# EAGLE schematic Sch (EAGLE 9.6.0)
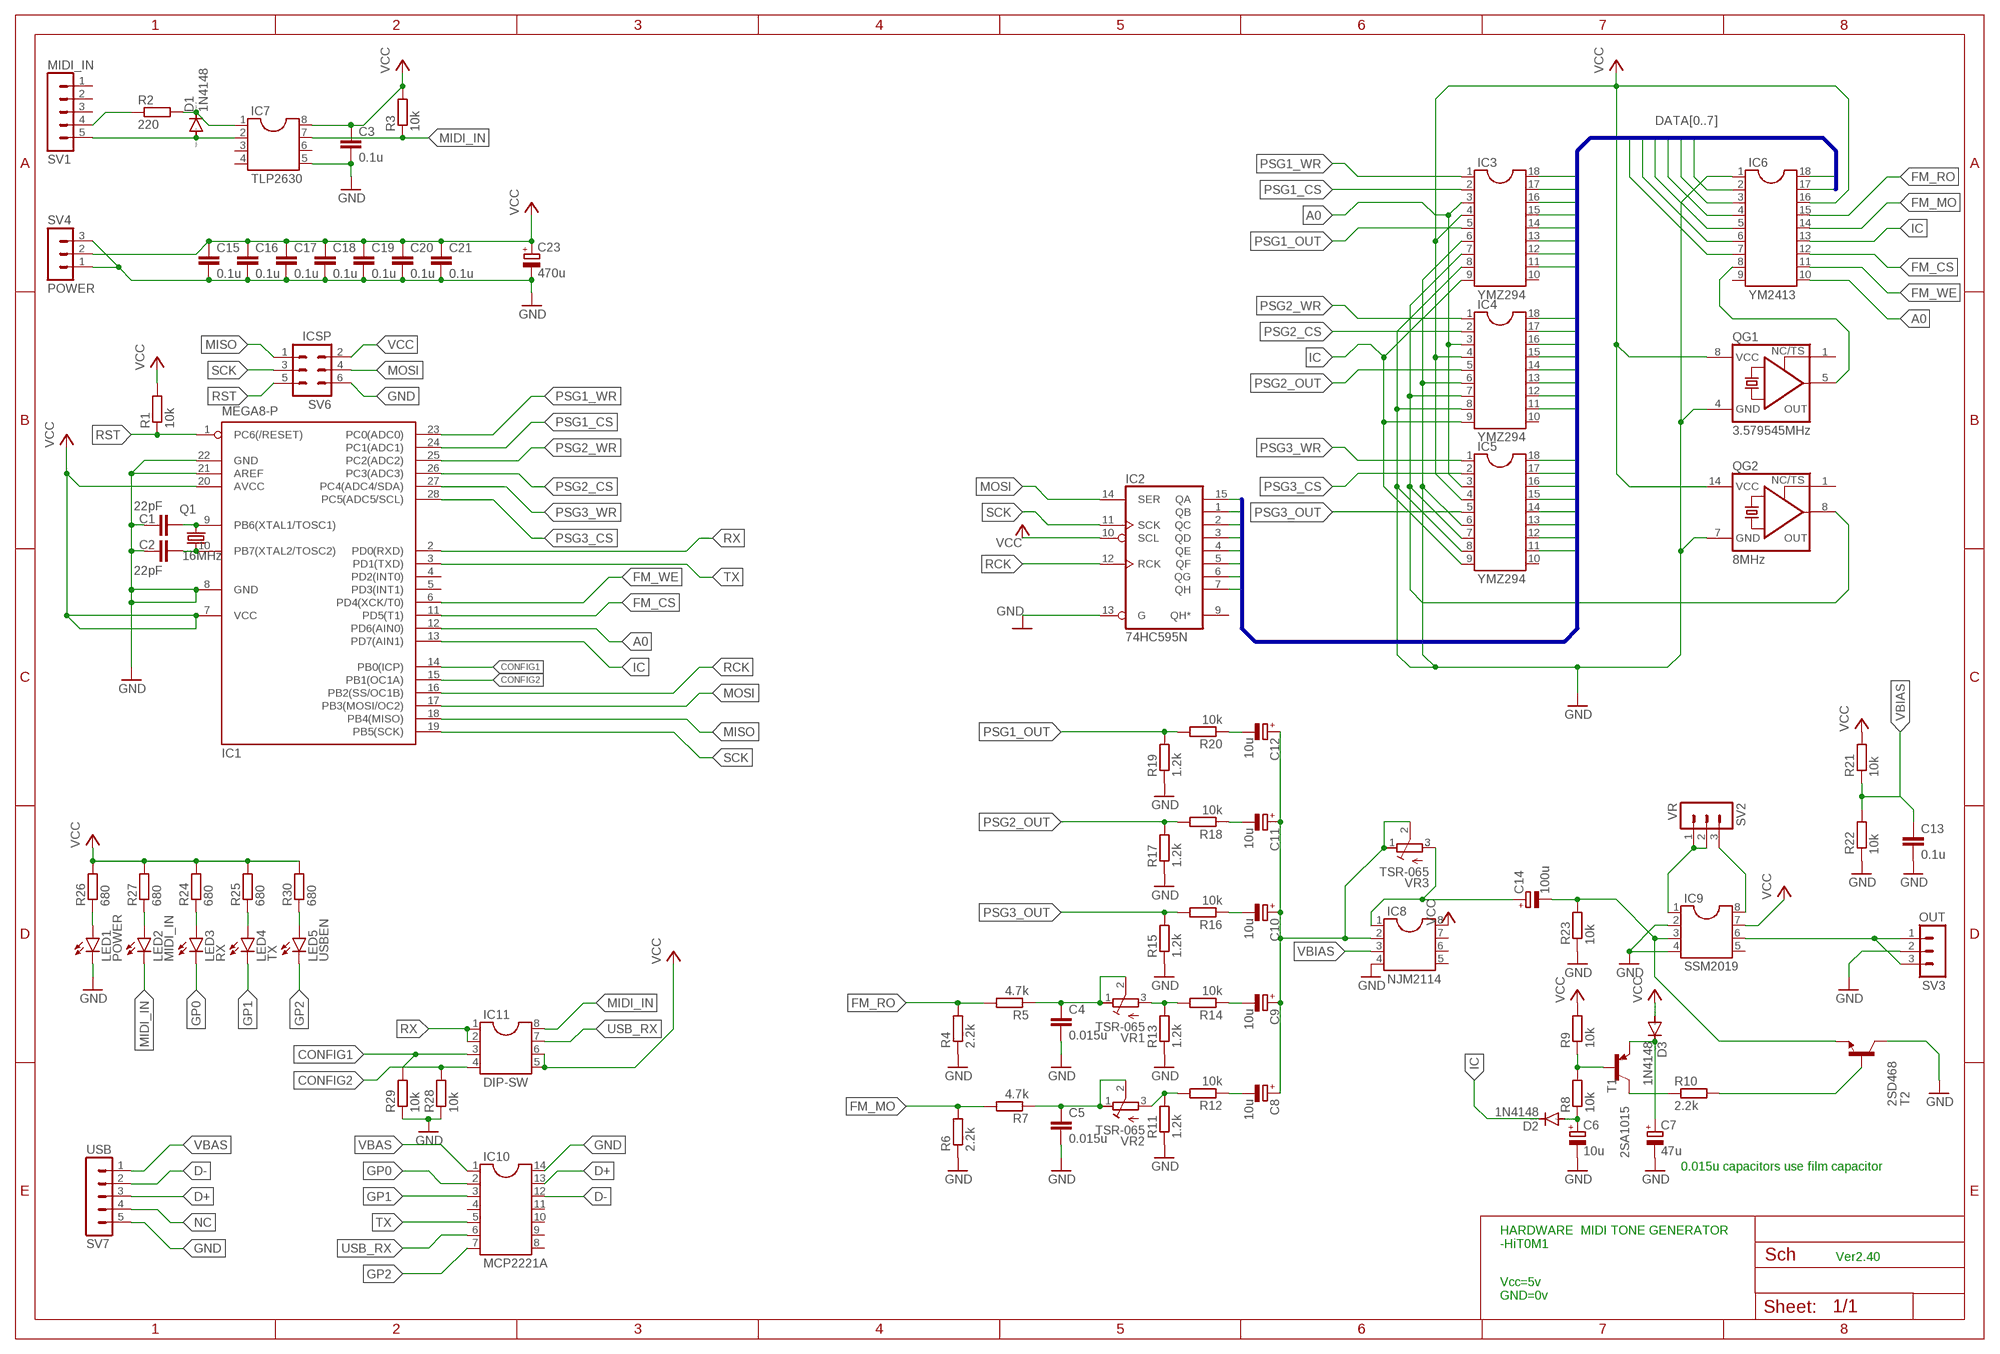
[diagram p0: schematic, sheet 1]

## Parts
C1  22pF  C-EU050-025X075  [C050-025X075]
C2  22pF  C-EU050-025X075  [C050-025X075]
C3  0.1u  C-EU025-030X050  [C025-030X050]
C4  0.015u  C-EU050-025X075  [C050-025X075]
C5  0.015u  C-EU050-025X075  [C050-025X075]
C6  10u  CPOL-EUE2.5-5  [E2,5-5]
C7  47u  CPOL-EUE2.5-5  [E2,5-5]
C8  10u  CPOL-EUE2.5-5  [E2,5-5]
C9  10u  CPOL-EUE2.5-5  [E2,5-5]
C10  10u  CPOL-EUE2.5-5  [E2,5-5]
C11  10u  CPOL-EUE2.5-5  [E2,5-5]
C12  10u  CPOL-EUE2.5-5  [E2,5-5]
C13  0.1u  C-EU025-030X050  [C025-030X050]
C14  100u  CPOL-EUE2.5-5  [E2,5-5]
C15  0.1u  C-EU025-030X050  [C025-030X050]
C16  0.1u  C-EU025-030X050  [C025-030X050]
C17  0.1u  C-EU025-030X050  [C025-030X050]
C18  0.1u  C-EU025-030X050  [C025-030X050]
C19  0.1u  C-EU025-030X050  [C025-030X050]
C20  0.1u  C-EU025-030X050  [C025-030X050]
C21  0.1u  C-EU025-030X050  [C025-030X050]
C23  470u  CPOL-EUE2.5-5  [E2,5-5]
D1  1N4148  1N4148DO35-7  [DO35-7]
D2  1N4148  1N4148DO35-7  [DO35-7]
D3  1N4148  1N4148DO35-7  [DO35-7]
IC1  MEGA8-P  [DIL28-3]
IC2  74HC595N  [DIL16]
IC3  YMZ294  DIL18S  [SOCKET-18]
IC4  YMZ294  DIL18S  [SOCKET-18]
IC5  YMZ294  DIL18S  [SOCKET-18]
IC6  YM2413  DIL18S  [SOCKET-18]
IC7  TLP2630  DIL8S  [SOCKET-08]
IC8  NJM2114  DIL8S  [SOCKET-08]
IC9  SSM2019  DIL8S  [SOCKET-08]
IC10  MCP2221A  DIL14S  [SOCKET-14]
IC11  DIP-SW  DIL8S  [SOCKET-08]
LED1  POWER  LED3MM  [LED3MM]
LED2  MIDI_IN  LED3MM  [LED3MM]
LED3  RX  LED3MM  [LED3MM]
LED4  TX  LED3MM  [LED3MM]
LED5  USBEN  LED3MM  [LED3MM]
Q1  16MHz  CRYSTALHC49S  [HC49/S]
QG1  3.579545MHz  XO-8  [DIL08S]
QG2  8MHz  XO-14  [DIL14S]
R1  10k  R-EU_0207/2V  [0207/2V]
R2  220  R-EU_0207/2V  [0207/2V]
R3  10k  R-EU_0207/2V  [0207/2V]
R4  2.2k  R-EU_0207/2V  [0207/2V]
R5  4.7k  R-EU_0207/2V  [0207/2V]
R6  2.2k  R-EU_0207/2V  [0207/2V]
R7  4.7k  R-EU_0207/2V  [0207/2V]
R8  10k  R-EU_0207/2V  [0207/2V]
R9  10k  R-EU_0207/2V  [0207/2V]
R10  2.2k  R-EU_0207/2V  [0207/2V]
R11  1.2k  R-EU_0207/2V  [0207/2V]
R12  10k  R-EU_0207/2V  [0207/2V]
R13  1.2k  R-EU_0207/2V  [0207/2V]
R14  10k  R-EU_0207/2V  [0207/2V]
R15  1.2k  R-EU_0207/2V  [0207/2V]
R16  10k  R-EU_0207/2V  [0207/2V]
R17  1.2k  R-EU_0207/2V  [0207/2V]
R18  10k  R-EU_0207/2V  [0207/2V]
R19  1.2k  R-EU_0207/2V  [0207/2V]
R20  10k  R-EU_0207/2V  [0207/2V]
R21  10k  R-EU_0207/2V  [0207/2V]
R22  10k  R-EU_0207/2V  [0207/2V]
R23  10k  R-EU_0207/2V  [0207/2V]
R24  680  R-EU_0207/2V  [0207/2V]
R25  680  R-EU_0207/2V  [0207/2V]
R26  680  R-EU_0207/2V  [0207/2V]
R27  680  R-EU_0207/2V  [0207/2V]
R28  10k  R-EU_0207/2V  [0207/2V]
R29  10k  R-EU_0207/2V  [0207/2V]
R30  680  R-EU_0207/2V  [0207/2V]
SV1  MIDI_IN  MA05-1  [MA05-1]
SV2  VR  MA03-1  [MA03-1]
SV3  OUT  MA03-1  [MA03-1]
SV4  POWER  MA03-1  [MA03-1]
SV6  ICSP  MA03-2  [MA03-2]
SV7  USB  MA05-1  [MA05-1]
T1  2SA1015  -PNP-TO92  [TO92]
T2  2SD468  -NPN-TO92  [TO92]
VR1  TSR-065  [TSR-065]
VR2  TSR-065  [TSR-065]
VR3  TSR-065  [TSR-065]

## Nets
A0: IC1.12(PD6(AIN0)) IC3.3 IC4.3 IC5.3 IC6.10
CONFIG1: IC1.14(PB0(ICP)) IC11.3 R29.2
CONFIG2: IC1.15(PB1(OC1A)) IC11.4 R28.2
D+: IC10.13 SV7.3
D-: IC10.12 SV7.2
DATA0: IC2.15(QA) IC3.18 IC4.18 IC5.18 IC6.17
DATA1: IC2.1(QB) IC3.17 IC4.17 IC5.17 IC6.18
DATA2: IC2.2(QC) IC3.16 IC4.16 IC5.16 IC6.2
DATA3: IC2.3(QD) IC3.15 IC4.15 IC5.15 IC6.3
DATA4: IC2.4(QE) IC3.14 IC4.14 IC5.14 IC6.4
DATA5: IC2.5(QF) IC3.13 IC4.13 IC5.13 IC6.5
DATA6: IC2.6(QG) IC3.12 IC4.12 IC5.12 IC6.6
DATA7: IC2.7(QH) IC3.11 IC4.11 IC5.11 IC6.7
FM_CS: IC1.11(PD5(T1)) IC6.12
FM_MO: IC6.14 R6.2 R7.2
FM_RO: IC6.15 R4.2 R5.2
FM_WE: IC1.6(PD4(XCK/T0)) IC6.11
GND: C1.2 C2.2 C3.2 C4.2 C5.2 C6.- C7.- C13.2 C15.2 C16.2 C17.2 C18.2 C19.2 C20.2 C21.2 C23.- IC1.8(GND) IC1.21(AREF) IC1.22(GND) IC2.13(G) IC3.6 IC3.8 IC4.6 IC4.8 IC5.6 IC5.8 IC6.1 IC7.5 IC8.4 IC9.2 IC9.4 IC10.14 LED1.K(C) QG1.4(GND) QG2.7(GND) R4.1 R6.1 R11.1 R13.1 R15.1 R17.1 R19.1 R22.1 R23.1 R28.1 R29.1 SV3.2 SV4.1 SV4.3 SV6.6 SV7.5 T2.3(C)
GP0: IC10.2 LED3.K(C)
GP1: IC10.3 LED4.K(C)
GP2: IC10.7 LED5.K(C)
IC: D2.C IC1.13(PD7(AIN1)) IC3.9 IC4.9 IC5.9 IC6.13
MIDI_IN: IC7.7 IC11.8 LED2.K(C) R3.1
MISO: IC1.18(PB4(MISO)) SV6.1
MOSI: IC1.17(PB3(MOSI/OC2)) IC2.14(SER) SV6.4
N$1: R2.1 SV1.4
N$2: D1.A IC7.2 SV1.5
N$3: C1.1 IC1.9(PB6(XTAL1/TOSC1)) Q1.2
N$4: C2.1 IC1.10(PB7(XTAL2/TOSC2)) Q1.1
N$5: D1.C IC7.1 R2.2
N$6: IC3.7 IC4.7 IC5.7 QG2.8(OUT)
N$7: C6.+ D2.A R8.1
N$8: C4.1 R5.1 VR1.1(A) VR1.2(S)
N$9: IC6.8 QG1.5(OUT)
N$10: C8.+ C9.+ C10.+ C11.+ C12.+ IC8.2 VR3.1(A) VR3.2(S)
N$11: C5.1 R7.1 VR2.1(A) VR2.2(S)
N$12: LED3.A R24.1
N$13: R8.2 R9.1 T1.2(B)
N$14: C7.+ D3.C T1.1(E)
N$15: R10.1 T1.3(C)
N$16: R10.2 T2.2(B)
N$17: C14.- IC9.3 R23.2 T2.1(E)
N$18: R11.2 R12.2 VR2.3(E)
N$19: C8.- R12.1
N$20: R13.2 R14.2 VR1.3(E)
N$21: C9.- R14.1
N$22: LED4.A R25.1
N$23: C10.- R16.1
N$24: LED5.A R30.1
N$25: C11.- R18.1
N$26: LED1.A R26.1
N$27: C12.- R20.1
N$29: C14.+ IC8.1 VR3.3(E)
N$30: IC9.1 SV2.1 SV2.2
N$31: IC9.8 SV2.3
N$32: LED2.A R27.1
N$33: IC9.6 SV3.1 SV3.3
NC: SV7.4
PSG1_CS: IC1.24(PC1(ADC1)) IC3.2
PSG1_OUT: IC3.5 R19.2 R20.2
PSG1_WR: IC1.23(PC0(ADC0)) IC3.1
PSG2_CS: IC1.26(PC3(ADC3)) IC4.2
PSG2_OUT: IC4.5 R17.2 R18.2
PSG2_WR: IC1.25(PC2(ADC2)) IC4.1
PSG3_CS: IC1.28(PC5(ADC5/SCL)) IC5.2
PSG3_OUT: IC5.5 R15.2 R16.2
PSG3_WR: IC1.27(PC4(ADC4/SDA)) IC5.1
RCK: IC1.16(PB2(SS/OC1B)) IC2.12(RCK)
RST: IC1.1(PC6(/RESET)) R1.1 SV6.5
RX: IC1.2(PD0(RXD)) IC11.1 IC11.2
SCK: IC1.19(PB5(SCK)) IC2.11(SCK) SV6.3
TX: IC1.3(PD1(TXD)) IC10.5
USB_RX: IC10.6 IC11.7
VBAS: IC10.1 SV7.1
VBIAS: C13.1 IC8.3 R21.1 R22.2
VCC: C3.1 C15.1 C16.1 C17.1 C18.1 C19.1 C20.1 C21.1 C23.+ D3.A IC1.7(VCC) IC1.20(AVCC) IC2.10(SCL) IC3.4 IC4.4 IC5.4 IC6.16 IC7.8 IC8.8 IC9.7 IC11.5 IC11.6 QG1.8(VCC) QG2.14(VCC) R1.2 R3.2 R9.2 R21.2 R24.2 R25.2 R26.2 R27.2 R30.2 SV4.2 SV6.2
Unconnected: IC1.4(PD2(INT0)) IC1.5(PD3(INT1)) IC2.9(QH*) IC3.10 IC4.10 IC5.10 IC6.9 IC7.3 IC7.4 IC7.6 IC8.5 IC8.6 IC8.7 IC9.5 IC10.4 IC10.8 IC10.9 IC10.10 IC10.11 QG1.1(TS) QG2.1(TS) SV1.1 SV1.2 SV1.3

## Buses
DATA[0..7]

## Notes on the sheet
- 0.015u capacitors use film capacitor
- HARDWARE  MIDI TONE GENERATOR 
  -HiT0M1
- Ver2.40
- Vcc=5v
  GND=0v

## Power pins joined to a net without a drawn wire
GND: IC2.8(GND)
VCC: IC2.16(VCC)

## Library data of the parts
C1-C5 C13 C15-C21 = rcl:C-EU: CAPACITOR, European symbol; SPICEPREFIX: C
C6-C12 C14 C23 = rcl:CPOL-EU: POLARIZED CAPACITOR, European symbol; SPICEPREFIX: C
D1-D3 = diode:1N4148: DIODE high speed (Philips)
IC1 = atmel:MEGA8-P: MICROCONTROLLER 8 Kbytes FLASH, 1 kbytes SRAM, 512 bytes EEPROM, USART, 4-channel 10 bit ADC, 2-channel 8 bit ADC Pin compatible with Atmega48, ATMega88, ATMega168 Source: avr.lbr; OC_FARNELL: unknown; OC_NEWARK: unknown
IC2 = 74xx-eu:74*595: 8-bit SHIFT REGISTER, output latch
IC3-IC6 = ic-package:DIL18: Dual In Line / Socket
IC7-IC9 IC11 = ic-package:DIL8: Dual In Line / Socket
IC10 = ic-package:DIL14: Dual In Line / Socket
LED1-LED5 = led:LED: LED OSRAM: - CHIPLED LG R971, LG N971, LY N971, LG Q971, LY Q971, LO R971, LY R971 LH N974, LH R974 LS Q976, LO Q976, LY Q976 LO Q996 - Hyper CHIPLED LW Q18S LB Q993, LB Q99A, LB R99A - SideLED LS A670, LO A670, LY A670, LG A670, LP A670 LB A673, LV A673, LT A673, LW A673 LH A674 LY A675 LS A676, LA A676, LO A676, LY A676, LW A676 LS A679, LY A679, LG A679 - Hyper Micro SIDELED® LS Y876, LA Y876, LO Y876, LY Y876 LT Y87S - SmartLED LW L88C, LW L88S LB L89C, LB L89S, LG L890 LS L89K, LO L89K, LY L89K LS L896, LA L896, LO L896, LY L896 - TOPLED LS T670, LO T670, LY T670, LG T670, LP T670 LSG T670, LSP T670, LSY T670, LOP T670, LYG T670 LG T671, LOG T671, LSG T671 LB T673, LV T673, LT T673, LW T673 LH T674 LS T676, LA T676, LO T676, LY T676, LB T676, LH T676, LSB T676, LW T676 LB T67C, LV T67C, LT T67C, LS T67K, LO T67K, LY T67K, LW E67C LS E67B, LA E67B, LO E67B, LY E67B, LB E67C, LV E67C, LT E67C LW T67C LS T679, LY T679, LG T679 LS T770, LO T770, LY T770, LG T770, LP T770 LB T773, LV T773, LT T773, LW T773 LH T774 LS E675, LA E675, LY E675, LS T675 LS T776, LA T776, LO T776, LY T776, LB T776 LHGB T686 LT T68C, LB T68C - Hyper Mini TOPLED® LB M676 - Mini TOPLED Santana® LG M470 LS M47K, LO M47K, LY M47K Source: http://www.osram.convergy.de LUXEON: - LUMILED® LXK2-PW12-R00, LXK2-PW12-S00, LXK2-PW14-U00, LXK2-PW14-V00 LXK2-PM12-R00, LXK2-PM12-S00, LXK2-PM14-U00 LXK2-PE12-Q00, LXK2-PE12-R00, LXK2-PE12-S00, LXK2-PE14-T00, LXK2-PE14-U00 LXK2-PB12-K00, LXK2-PB12-L00, LXK2-PB12-M00, LXK2-PB14-N00, LXK2-PB14-P00, LXK2-PB14-Q00 LXK2-PR12-L00, LXK2-PR12-M00, LXK2-PR14-Q00, LXK2-PR14-R00 LXK2-PD12-Q00, LXK2-PD12-R00, LXK2-PD12-S00 LXK2-PH12-R00, LXK2-PH12-S00 LXK2-PL12-P00, LXK2-PL12-Q00, LXK2-PL12-R00 Source: www.luxeon.com KINGBRIGHT: KA-3528ASYC Source: www.kingbright.com
Q1 = crystal:CRYSTAL: CRYSTAL; OC_FARNELL: 1667008; OC_NEWARK: unknown
QG1 QG2 = crystal:XO-: CRYSTAL; OC_FARNELL: unknown; OC_NEWARK: unknown
R1-R30 = rcl:R-EU_: RESISTOR, European symbol; SPICEPREFIX: R
SV1 SV7 = con-lstb:MA05-1: PIN HEADER; OC_FARNELL: unknown; OC_NEWARK: unknown
SV2-SV4 = con-lstb:MA03-1: PIN HEADER; OC_FARNELL: unknown; OC_NEWARK: unknown
SV6 = con-lstb:MA03-2: PIN HEADER; OC_FARNELL: unknown; OC_NEWARK: unknown
T1 = transistor:*-PNP-: PNP Transistror
T2 = transistor:*-NPN-: NPN Transistror BF959 corrected 2008.03.06
VR1-VR3 = akizuki:TSR-065: TSR-065 Trimming Potentionmeter Suntan

## Net classes
0 default: width 0.457 mm, clearance 0.229 mm